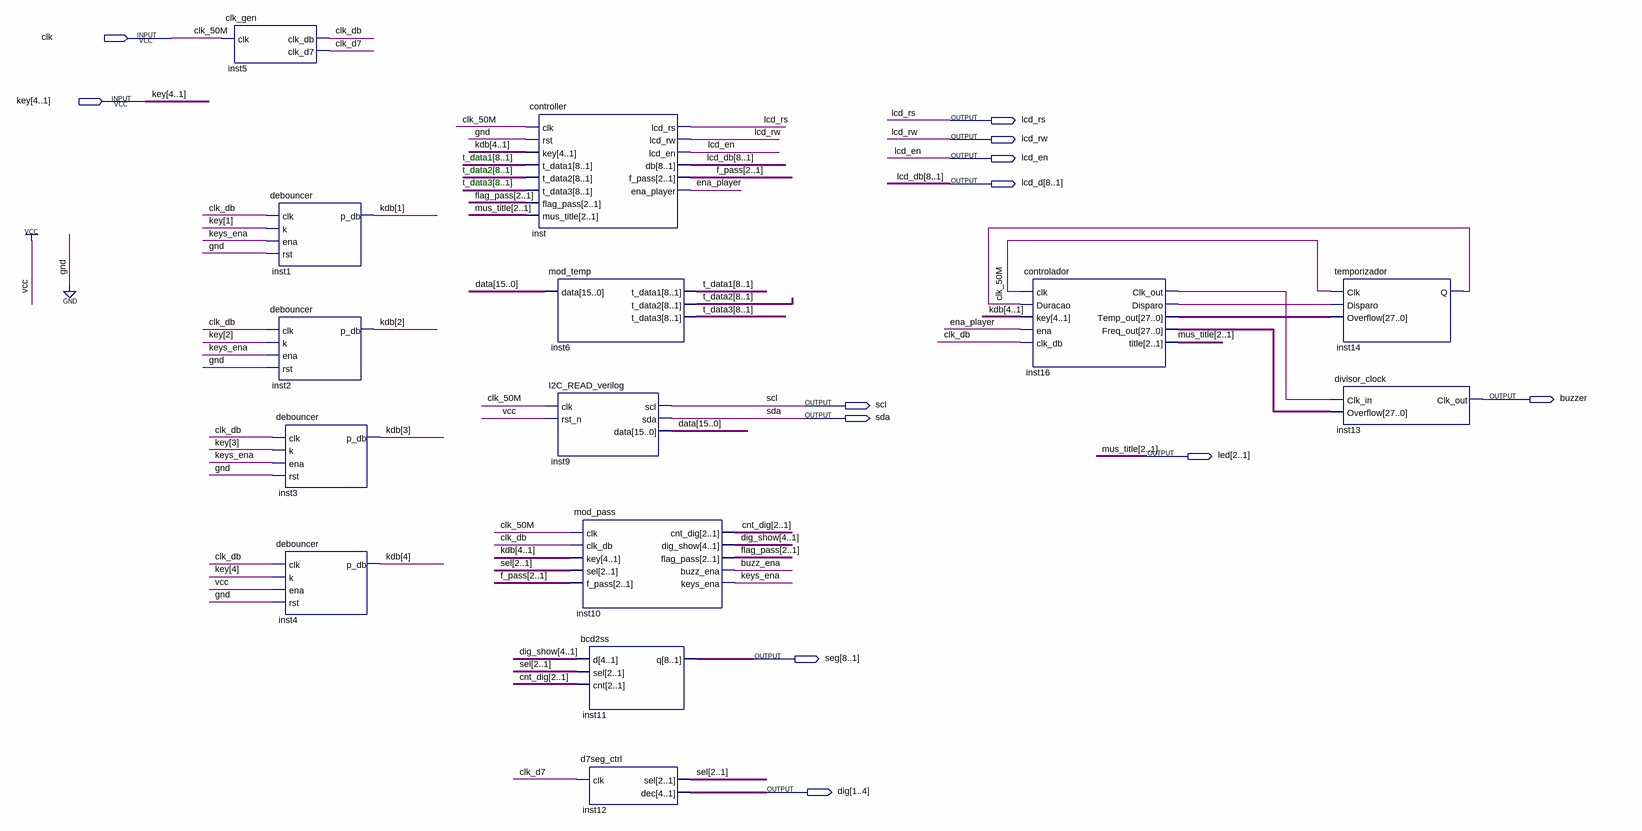
[diagram p0: schematic sheet]
// Quartus schematic test_controller.bdf as structural Verilog: 14 symbols, 12 pins
module test_controller (
  input  clk,
  input  [4:1] key,
  output lcd_rs,
  output lcd_rw,
  output lcd_en,
  output [8:1] lcd_d,
  output buzzer,
  output scl,
  output sda,
  output [2:1] led,
  output [8:1] seg,
  output [1:4] dig
);

  wire buzz_ena, clk_d7, clk_db, ena_player, inst14_q, inst16_clk_out, inst16_disparo, keys_ena;
  wire [2:1] cnt_dig, f_pass, flag_pass, sel;
  wire [4:1] dig_show, kdb;
  wire [8:1] t_data1, t_data2, t_data3;
  wire [15:0] data;
  wire [27:0] inst16_freq_out, inst16_temp_out;

  clk_gen inst5 (.clk(clk), .clk_db(clk_db), .clk_d7(clk_d7));
  debouncer inst1 (.clk(clk_db), .k(key[1]), .ena(keys_ena), .rst(1'b0), .p_db(kdb[1]));
  debouncer inst2 (.clk(clk_db), .k(key[2]), .ena(keys_ena), .rst(1'b0), .p_db(kdb[2]));
  debouncer inst3 (.clk(clk_db), .k(key[3]), .ena(keys_ena), .rst(1'b0), .p_db(kdb[3]));
  debouncer inst4 (.clk(clk_db), .k(key[4]), .ena(1'b1), .rst(1'b0), .p_db(kdb[4]));
  controller inst (
    .clk(clk), .rst(1'b0), .key(kdb), .t_data1(t_data1), .t_data2(t_data2), .t_data3(t_data3),
    .flag_pass(flag_pass), .mus_title(led), .lcd_rs(lcd_rs), .lcd_rw(lcd_rw), .lcd_en(lcd_en), .db(lcd_d),
    .f_pass(f_pass), .ena_player(ena_player));
  mod_temp inst6 (.data(data), .t_data1(t_data1), .t_data2(t_data2), .t_data3(t_data3));
  I2C_READ_verilog inst9 (.clk(clk), .rst_n(1'b1), .scl(scl), .data(data), .sda(sda));
  mod_pass inst10 (
    .clk(clk), .clk_db(clk_db), .key(kdb), .sel(sel), .f_pass(f_pass), .cnt_dig(cnt_dig),
    .dig_show(dig_show), .flag_pass(flag_pass), .buzz_ena(buzz_ena), .keys_ena(keys_ena));
  bcd2ss inst11 (.d(dig_show), .sel(sel), .cnt(cnt_dig), .q(seg));
  d7seg_ctrl inst12 (.clk(clk_d7), .sel(sel), .dec(dig));
  controlador inst16 (
    .clk(clk), .Duracao(inst14_q), .key(kdb), .ena(ena_player), .clk_db(clk_db), .Clk_out(inst16_clk_out),
    .Disparo(inst16_disparo), .Temp_out(inst16_temp_out), .Freq_out(inst16_freq_out), .title(led));
  temporizador inst14 (.Clk(clk), .Disparo(inst16_disparo), .Overflow(inst16_temp_out), .Q(inst14_q));
  divisor_clock inst13 (.Clk_in(inst16_clk_out), .Overflow(inst16_freq_out), .Clk_out(buzzer));

  // Other names for the same wires on the sheet: clk_50M = clk; lcd_db[8:1] = lcd_d; mus_title[2:1] = led

  // Notes on the sheet:
  //   t_data1[8..1]
  //   t_data2[8..1]
  //   t_data3[8..1]
endmodule
